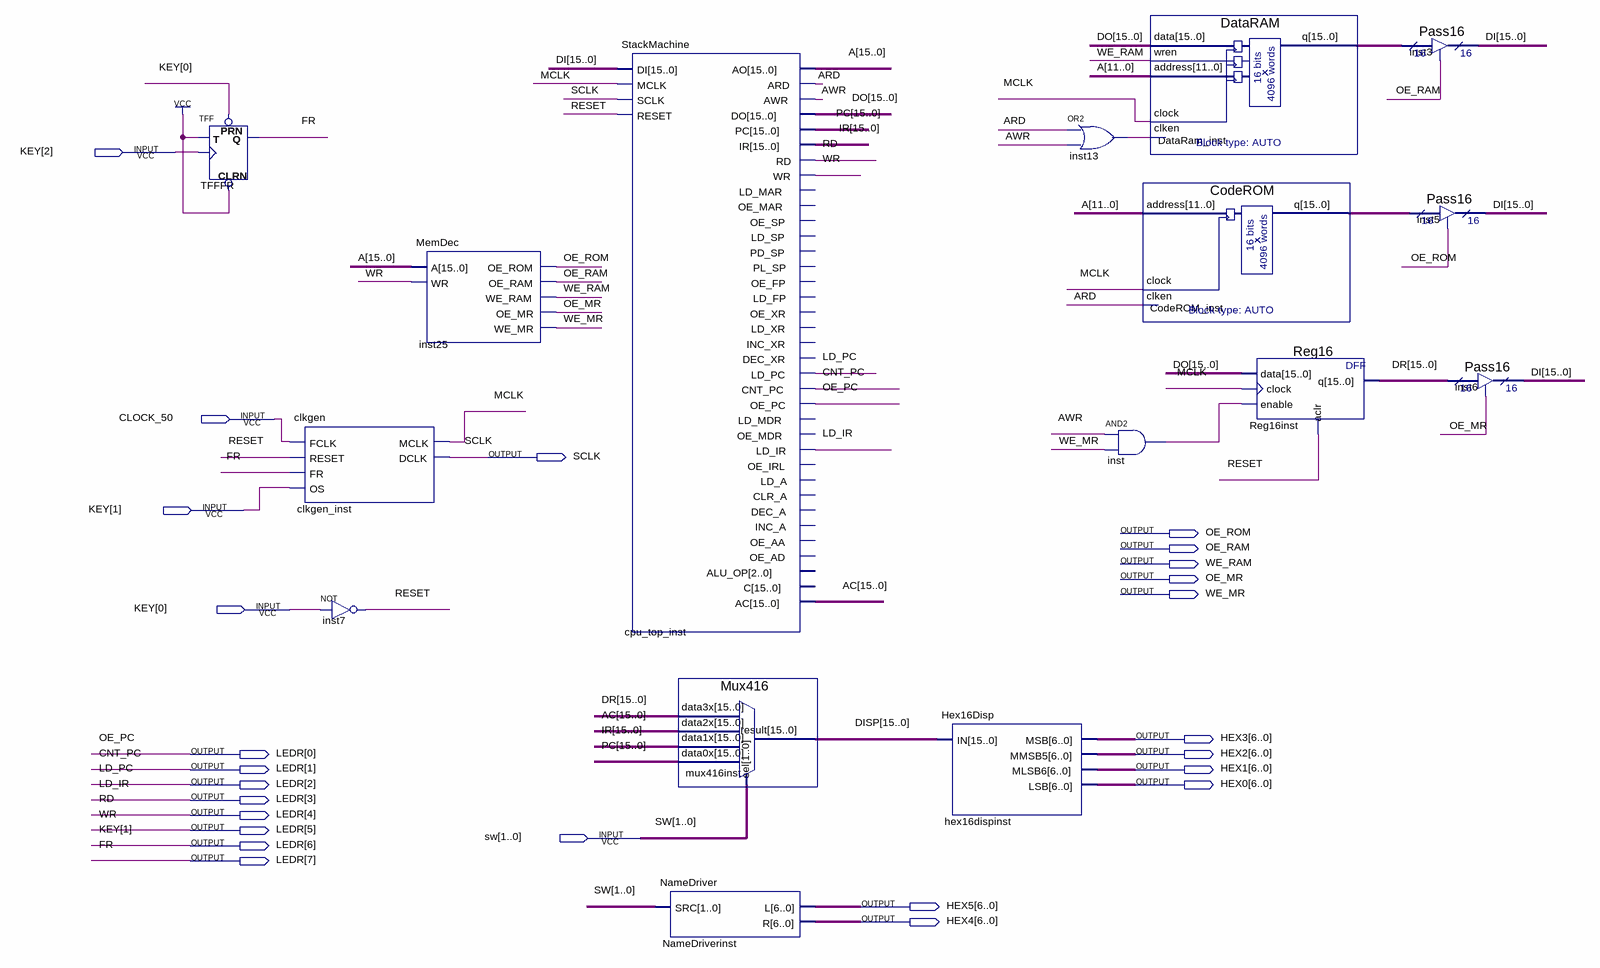
[diagram p0: schematic sheet]
// Quartus schematic S4_DE10.bdf as structural Verilog: 16 symbols, 25 pins
module S4_DE10 (
  input  [2:0] KEY,
  input  CLOCK_50,
  input  [1:0] sw,
  output SCLK,
  output OE_ROM,
  output OE_RAM,
  output WE_RAM,
  output OE_MR,
  output WE_MR,
  output [6:0] HEX3,
  output [7:0] LEDR,
  output [6:0] HEX2,
  output [6:0] HEX1,
  output [6:0] HEX0,
  output [6:0] HEX5,
  output [6:0] HEX4
);

  wire ARD, AWR, inst13_out, inst_out, MCLK, RESET;
  wire [15:0] A, AC, CodeROM_inst_q, DataRam_inst_q, DI, DISP, DO, DR, IR, PC;

  TFF TFFFR (.PRN(KEY[0]), .CLRN(1'b1), .T(1'b1), .CLK(KEY[2]), .Q(LEDR[7]));
  clkgen clkgen_inst (.FCLK(CLOCK_50), .RESET(RESET), .FR(LEDR[7]), .OS(KEY[1]), .MCLK(MCLK), .DCLK(SCLK));
  not inst7 (RESET, KEY[0]);
  MemDec inst25 (.A(A), .WR(LEDR[5]), .OE_ROM(OE_ROM), .OE_RAM(OE_RAM), .WE_RAM(WE_RAM), .OE_MR(OE_MR), .WE_MR(WE_MR));
  StackMachine cpu_top_inst (
    .DI(DI), .MCLK(MCLK), .SCLK(SCLK), .RESET(RESET), .AO(A), .ARD(ARD), .AWR(AWR), .DO(DO), .PC(PC),
    .IR(IR), .RD(LEDR[4]), .WR(LEDR[5]), .LD_PC(LEDR[2]), .CNT_PC(LEDR[1]), .OE_PC(LEDR[0]), .LD_IR(LEDR[3]),
    .AC(AC));  // open: LD_MAR, OE_MAR, OE_SP, LD_SP, PD_SP, PL_SP, OE_FP, LD_FP, OE_XR, LD_XR, INC_XR, DEC_XR, LD_MDR, OE_MDR, OE_IRL, LD_A, CLR_A, DEC_A, INC_A, OE_AA, OE_AD, ALU_OP, C
  Mux416 mux416inst (.data3x(DR), .data2x(AC), .data1x(IR), .data0x(PC), .sel(sw), .result(DISP));
  NameDriver NameDriverinst (.SRC(sw), .L(HEX5), .R(HEX4));
  Hex16Disp hex16dispinst (.IN(DISP), .MSB(HEX3), .MMSB5(HEX2), .MLSB6(HEX1), .LSB(HEX0));
  or inst13 (inst13_out, ARD, AWR);
  and inst (inst_out, AWR, WE_MR);
  DataRAM DataRam_inst (
    .data(DO), .wren(WE_RAM), .address(A[11:0]), .clock(MCLK), .clken(inst13_out), .q(DataRam_inst_q));
  CodeROM CodeROM_inst (.address(A[11:0]), .clock(MCLK), .clken(ARD), .q(CodeROM_inst_q));
  Reg16 Reg16inst (.data(DO), .clock(MCLK), .enable(inst_out), .aclr(RESET), .q(DR));
  Pass16 inst3 (.enabledt(OE_RAM), .data(DataRam_inst_q), .tridata(DI));
  Pass16 inst5 (.enabledt(OE_ROM), .data(CodeROM_inst_q), .tridata(DI));
  Pass16 inst6 (.enabledt(OE_MR), .data(DR), .tridata(DI));

  assign LEDR[6] = KEY[1];

  // Other names for the same wires on the sheet: CNT_PC = LEDR[1]; FR = LEDR[7]; LD_IR = LEDR[3]; LD_PC = LEDR[2];
  //   OE_PC = LEDR[0]; RD = LEDR[4]; WR = LEDR[5]
endmodule
